# EAGLE design contacto2 (EAGLE 9.1.3)
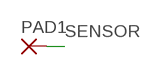
[diagram p0: schematic, sheet 1]

## Parts
PAD1  1,6/0,9  [1,6/0,9]

## Nets
SENSOR: PAD1.1(P)

## Library data of the parts
PAD1 = wirepad:1,6/0,9: THROUGH-HOLE PAD

## Board
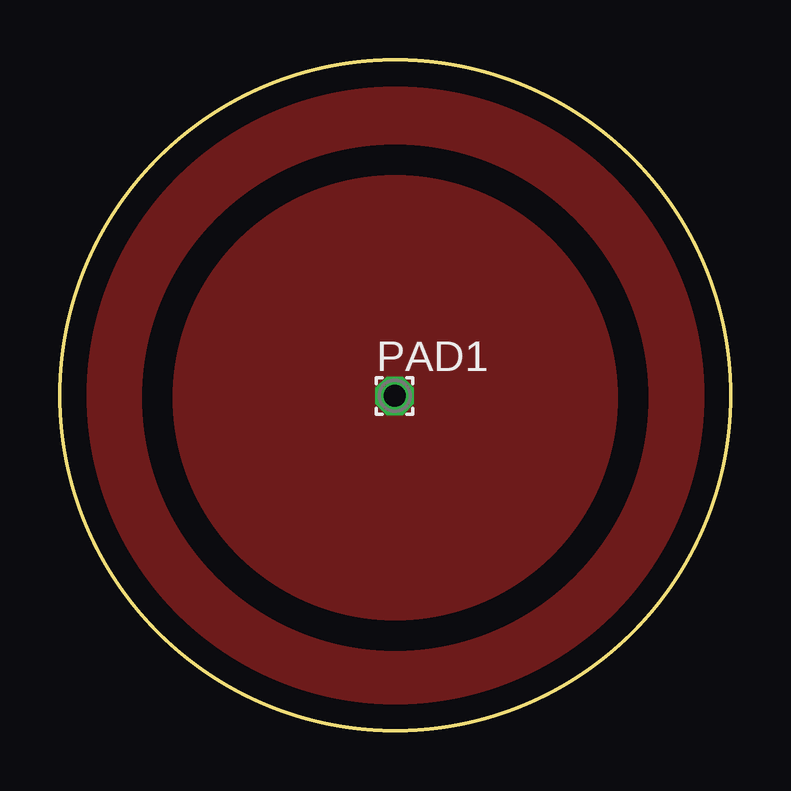
[diagram p1: board, top side]
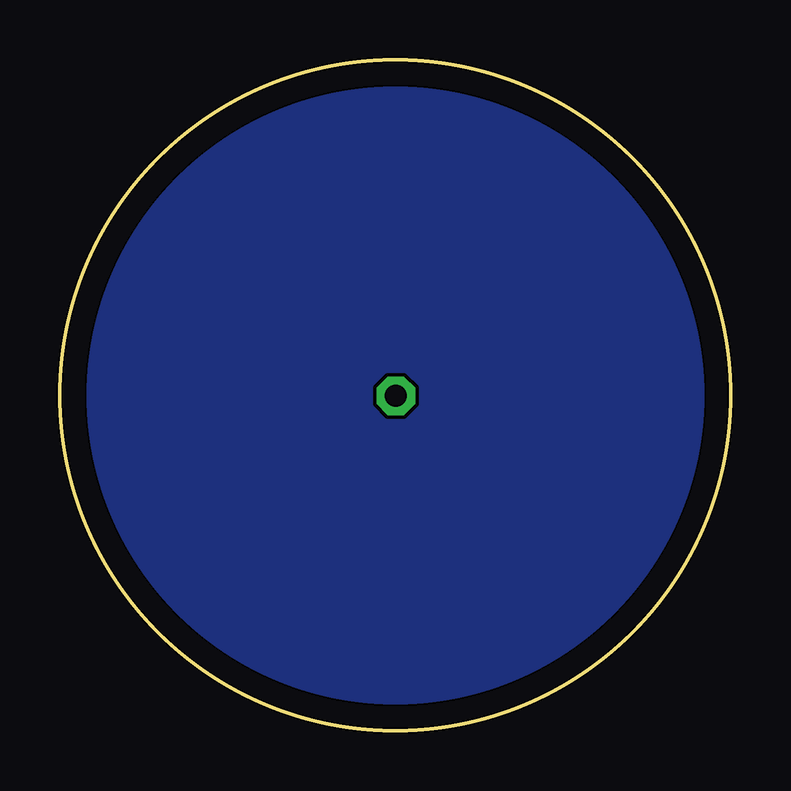
[diagram p2: board, bottom side, seen from below]

Size 27.94 x 27.94 mm. Coordinates in mm from the lower left corner, seen from the top.
Outline: circle at 13.97,13.97 radius 13.97
Copper layers (1*16): Top 0.035mm / dielectric 1.5mm / Bottom 0.035mm
Design rules "default": minimum track width 6mil, minimum drill 0.35mm, track to track 6mil, track to pad 6mil, pad to pad 6mil, via to via 6mil, smd to smd 6mil, copper to edge 40mil, drill to drill 6mil, minimum pad ring 10mil, minimum via ring 8mil, stop-mask expansion 4mil, vias tented up to drill 0mil, thermal gap 10mil
tRestrict: area 4.1,4 to 23.9,23.8

### Footprints (pad centres in the part's own frame; a part is rotated, then mirrored left to right if it is on the bottom)
1,6/0,9 = drill 0.914 pad 1.6 octagon: 1 0,0

### Placement (x,y rotation side)
PAD1  13.94,13.94 0 top

### Tracks (layer width: path | path; a pad name or v marks a point on that pad's centre or on a via)
ARMOR
  pour Top: 11,27.58 10.49,27.51 arc36 4.91,24.75 arc124 11.93,0.64 arc207
GND
  pour Bottom: 8.08,26.82 5.26,24.77 arc60 0.01,12.85 arc124 23.09,3.56 arc96 23.79,23.68 arc65
SENSOR
  pour Top: 8.36,26.54 6.92,25.81 arc76 0.09,11.21 arc124 23.88,4.76 arc158